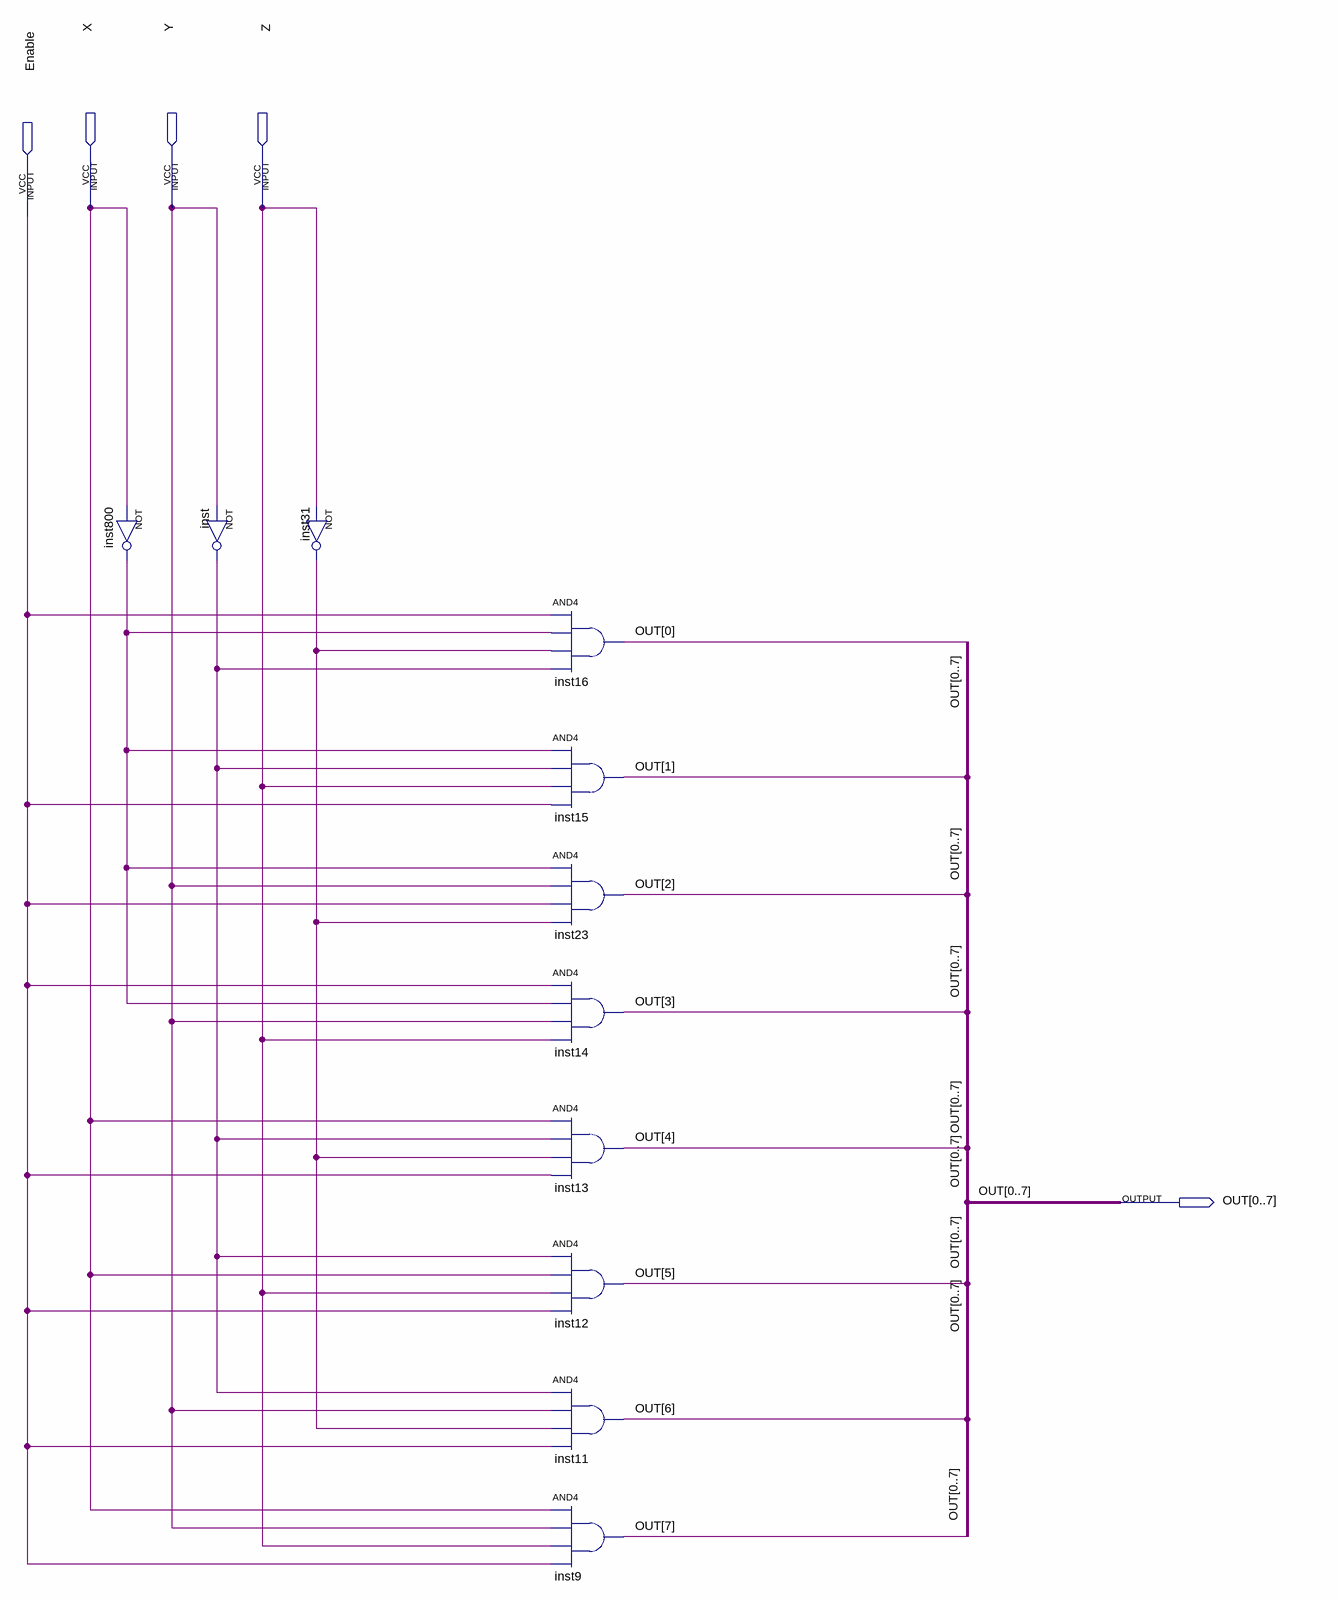
[diagram p0: schematic sheet]
// Quartus schematic Decoder3to8.bdf as structural Verilog: 11 symbols, 5 pins
module Decoder3to8 (
  input  X,
  input  Y,
  input  Z,
  input  Enable,
  output [0:7] OUT
);

  wire inst31_out, inst800_out, inst_out;

  not inst800 (inst800_out, X);
  not inst (inst_out, Y);
  not inst31 (inst31_out, Z);
  and inst16 (OUT[0], Enable, inst800_out, inst31_out, inst_out);
  and inst15 (OUT[1], inst800_out, inst_out, Z, Enable);
  and inst23 (OUT[2], inst800_out, Y, Enable, inst31_out);
  and inst14 (OUT[3], Enable, inst800_out, Y, Z);
  and inst13 (OUT[4], X, inst_out, inst31_out, Enable);
  and inst12 (OUT[5], inst_out, X, Z, Enable);
  and inst11 (OUT[6], inst_out, Y, inst31_out, Enable);
  and inst9 (OUT[7], X, Y, Z, Enable);
endmodule
